# EAGLE schematic 12s9p_segment (EAGLE 9.2.2)

## Sheet 1 of 2
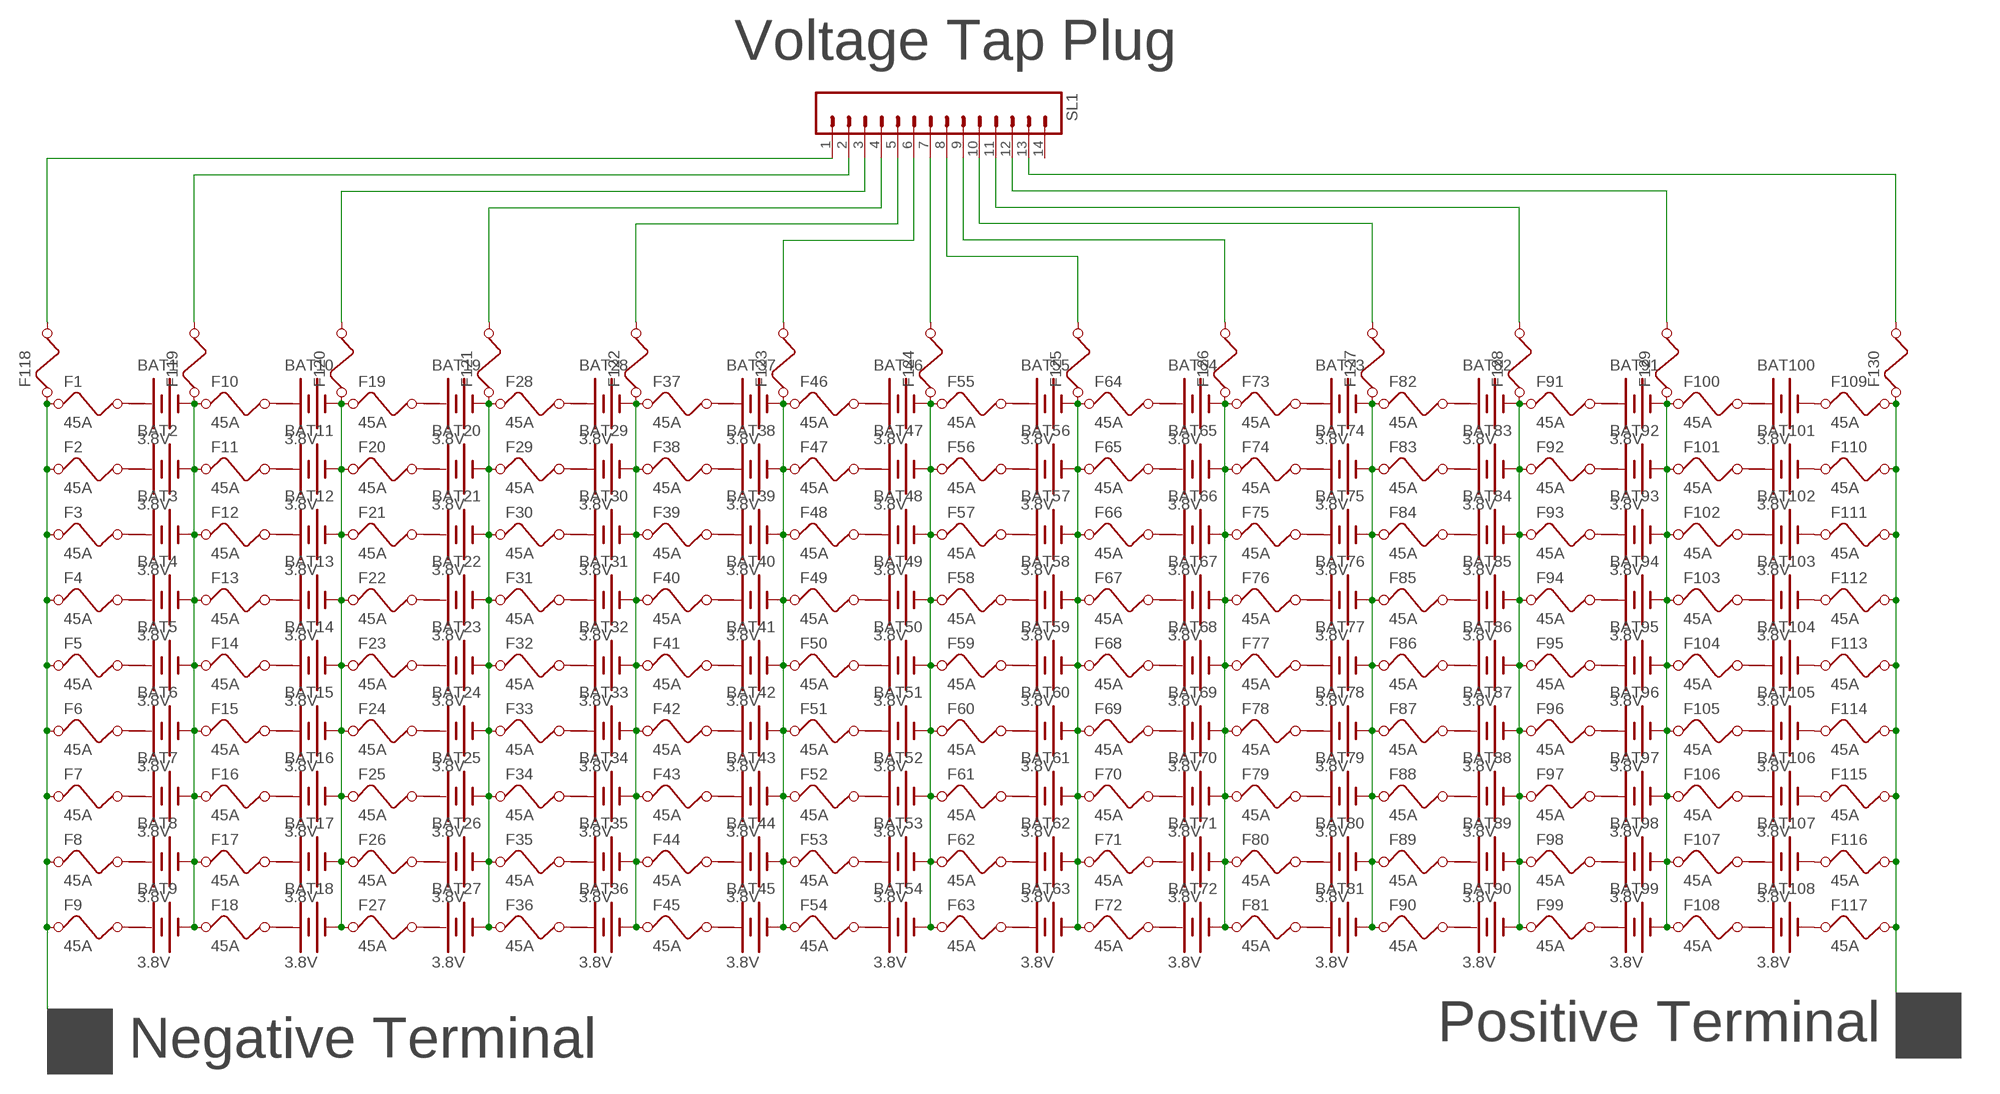
[diagram p0: schematic, sheet 1]

### Parts
BAT1  3.8V  BATTERY  [BATTERY]
BAT2  3.8V  BATTERY  [BATTERY]
BAT3  3.8V  BATTERY  [BATTERY]
BAT4  3.8V  BATTERY  [BATTERY]
BAT5  3.8V  BATTERY  [BATTERY]
BAT6  3.8V  BATTERY  [BATTERY]
BAT7  3.8V  BATTERY  [BATTERY]
BAT8  3.8V  BATTERY  [BATTERY]
BAT9  3.8V  BATTERY  [BATTERY]
BAT10  3.8V  BATTERY  [BATTERY]
BAT11  3.8V  BATTERY  [BATTERY]
BAT12  3.8V  BATTERY  [BATTERY]
BAT13  3.8V  BATTERY  [BATTERY]
BAT14  3.8V  BATTERY  [BATTERY]
BAT15  3.8V  BATTERY  [BATTERY]
BAT16  3.8V  BATTERY  [BATTERY]
BAT17  3.8V  BATTERY  [BATTERY]
BAT18  3.8V  BATTERY  [BATTERY]
BAT19  3.8V  BATTERY  [BATTERY]
BAT20  3.8V  BATTERY  [BATTERY]
BAT21  3.8V  BATTERY  [BATTERY]
BAT22  3.8V  BATTERY  [BATTERY]
BAT23  3.8V  BATTERY  [BATTERY]
BAT24  3.8V  BATTERY  [BATTERY]
BAT25  3.8V  BATTERY  [BATTERY]
BAT26  3.8V  BATTERY  [BATTERY]
BAT27  3.8V  BATTERY  [BATTERY]
BAT28  3.8V  BATTERY  [BATTERY]
BAT29  3.8V  BATTERY  [BATTERY]
BAT30  3.8V  BATTERY  [BATTERY]
BAT31  3.8V  BATTERY  [BATTERY]
BAT32  3.8V  BATTERY  [BATTERY]
BAT33  3.8V  BATTERY  [BATTERY]
BAT34  3.8V  BATTERY  [BATTERY]
BAT35  3.8V  BATTERY  [BATTERY]
BAT36  3.8V  BATTERY  [BATTERY]
BAT37  3.8V  BATTERY  [BATTERY]
BAT38  3.8V  BATTERY  [BATTERY]
BAT39  3.8V  BATTERY  [BATTERY]
BAT40  3.8V  BATTERY  [BATTERY]
BAT41  3.8V  BATTERY  [BATTERY]
BAT42  3.8V  BATTERY  [BATTERY]
BAT43  3.8V  BATTERY  [BATTERY]
BAT44  3.8V  BATTERY  [BATTERY]
BAT45  3.8V  BATTERY  [BATTERY]
BAT46  3.8V  BATTERY  [BATTERY]
BAT47  3.8V  BATTERY  [BATTERY]
BAT48  3.8V  BATTERY  [BATTERY]
BAT49  3.8V  BATTERY  [BATTERY]
BAT50  3.8V  BATTERY  [BATTERY]
BAT51  3.8V  BATTERY  [BATTERY]
BAT52  3.8V  BATTERY  [BATTERY]
BAT53  3.8V  BATTERY  [BATTERY]
BAT54  3.8V  BATTERY  [BATTERY]
BAT55  3.8V  BATTERY  [BATTERY]
BAT56  3.8V  BATTERY  [BATTERY]
BAT57  3.8V  BATTERY  [BATTERY]
BAT58  3.8V  BATTERY  [BATTERY]
BAT59  3.8V  BATTERY  [BATTERY]
BAT60  3.8V  BATTERY  [BATTERY]
BAT61  3.8V  BATTERY  [BATTERY]
BAT62  3.8V  BATTERY  [BATTERY]
BAT63  3.8V  BATTERY  [BATTERY]
BAT64  3.8V  BATTERY  [BATTERY]
BAT65  3.8V  BATTERY  [BATTERY]
BAT66  3.8V  BATTERY  [BATTERY]
BAT67  3.8V  BATTERY  [BATTERY]
BAT68  3.8V  BATTERY  [BATTERY]
BAT69  3.8V  BATTERY  [BATTERY]
BAT70  3.8V  BATTERY  [BATTERY]
BAT71  3.8V  BATTERY  [BATTERY]
BAT72  3.8V  BATTERY  [BATTERY]
BAT73  3.8V  BATTERY  [BATTERY]
BAT74  3.8V  BATTERY  [BATTERY]
BAT75  3.8V  BATTERY  [BATTERY]
BAT76  3.8V  BATTERY  [BATTERY]
BAT77  3.8V  BATTERY  [BATTERY]
BAT78  3.8V  BATTERY  [BATTERY]
BAT79  3.8V  BATTERY  [BATTERY]
BAT80  3.8V  BATTERY  [BATTERY]
BAT81  3.8V  BATTERY  [BATTERY]
BAT82  3.8V  BATTERY  [BATTERY]
BAT83  3.8V  BATTERY  [BATTERY]
BAT84  3.8V  BATTERY  [BATTERY]
BAT85  3.8V  BATTERY  [BATTERY]
BAT86  3.8V  BATTERY  [BATTERY]
BAT87  3.8V  BATTERY  [BATTERY]
BAT88  3.8V  BATTERY  [BATTERY]
BAT89  3.8V  BATTERY  [BATTERY]
BAT90  3.8V  BATTERY  [BATTERY]
BAT91  3.8V  BATTERY  [BATTERY]
BAT92  3.8V  BATTERY  [BATTERY]
BAT93  3.8V  BATTERY  [BATTERY]
BAT94  3.8V  BATTERY  [BATTERY]
BAT95  3.8V  BATTERY  [BATTERY]
BAT96  3.8V  BATTERY  [BATTERY]
BAT97  3.8V  BATTERY  [BATTERY]
BAT98  3.8V  BATTERY  [BATTERY]
BAT99  3.8V  BATTERY  [BATTERY]
BAT100  3.8V  BATTERY  [BATTERY]
BAT101  3.8V  BATTERY  [BATTERY]
BAT102  3.8V  BATTERY  [BATTERY]
BAT103  3.8V  BATTERY  [BATTERY]
BAT104  3.8V  BATTERY  [BATTERY]
BAT105  3.8V  BATTERY  [BATTERY]
BAT106  3.8V  BATTERY  [BATTERY]
BAT107  3.8V  BATTERY  [BATTERY]
BAT108  3.8V  BATTERY  [BATTERY]
F1  45A  FUSE  [FUSE]
F2  45A  FUSE  [FUSE]
F3  45A  FUSE  [FUSE]
F4  45A  FUSE  [FUSE]
F5  45A  FUSE  [FUSE]
F6  45A  FUSE  [FUSE]
F7  45A  FUSE  [FUSE]
F8  45A  FUSE  [FUSE]
F9  45A  FUSE  [FUSE]
F10  45A  FUSE  [FUSE]
F11  45A  FUSE  [FUSE]
F12  45A  FUSE  [FUSE]
F13  45A  FUSE  [FUSE]
F14  45A  FUSE  [FUSE]
F15  45A  FUSE  [FUSE]
F16  45A  FUSE  [FUSE]
F17  45A  FUSE  [FUSE]
F18  45A  FUSE  [FUSE]
F19  45A  FUSE  [FUSE]
F20  45A  FUSE  [FUSE]
F21  45A  FUSE  [FUSE]
F22  45A  FUSE  [FUSE]
F23  45A  FUSE  [FUSE]
F24  45A  FUSE  [FUSE]
F25  45A  FUSE  [FUSE]
F26  45A  FUSE  [FUSE]
F27  45A  FUSE  [FUSE]
F28  45A  FUSE  [FUSE]
F29  45A  FUSE  [FUSE]
F30  45A  FUSE  [FUSE]
F31  45A  FUSE  [FUSE]
F32  45A  FUSE  [FUSE]
F33  45A  FUSE  [FUSE]
F34  45A  FUSE  [FUSE]
F35  45A  FUSE  [FUSE]
F36  45A  FUSE  [FUSE]
F37  45A  FUSE  [FUSE]
F38  45A  FUSE  [FUSE]
F39  45A  FUSE  [FUSE]
F40  45A  FUSE  [FUSE]
F41  45A  FUSE  [FUSE]
F42  45A  FUSE  [FUSE]
F43  45A  FUSE  [FUSE]
F44  45A  FUSE  [FUSE]
F45  45A  FUSE  [FUSE]
F46  45A  FUSE  [FUSE]
F47  45A  FUSE  [FUSE]
F48  45A  FUSE  [FUSE]
F49  45A  FUSE  [FUSE]
F50  45A  FUSE  [FUSE]
F51  45A  FUSE  [FUSE]
F52  45A  FUSE  [FUSE]
F53  45A  FUSE  [FUSE]
F54  45A  FUSE  [FUSE]
F55  45A  FUSE  [FUSE]
F56  45A  FUSE  [FUSE]
F57  45A  FUSE  [FUSE]
F58  45A  FUSE  [FUSE]
F59  45A  FUSE  [FUSE]
F60  45A  FUSE  [FUSE]
F61  45A  FUSE  [FUSE]
F62  45A  FUSE  [FUSE]
F63  45A  FUSE  [FUSE]
F64  45A  FUSE  [FUSE]
F65  45A  FUSE  [FUSE]
F66  45A  FUSE  [FUSE]
F67  45A  FUSE  [FUSE]
F68  45A  FUSE  [FUSE]
F69  45A  FUSE  [FUSE]
F70  45A  FUSE  [FUSE]
F71  45A  FUSE  [FUSE]
F72  45A  FUSE  [FUSE]
F73  45A  FUSE  [FUSE]
F74  45A  FUSE  [FUSE]
F75  45A  FUSE  [FUSE]
F76  45A  FUSE  [FUSE]
F77  45A  FUSE  [FUSE]
F78  45A  FUSE  [FUSE]
F79  45A  FUSE  [FUSE]
F80  45A  FUSE  [FUSE]
F81  45A  FUSE  [FUSE]
F82  45A  FUSE  [FUSE]
F83  45A  FUSE  [FUSE]
F84  45A  FUSE  [FUSE]
F85  45A  FUSE  [FUSE]
F86  45A  FUSE  [FUSE]
F87  45A  FUSE  [FUSE]
F88  45A  FUSE  [FUSE]
F89  45A  FUSE  [FUSE]
F90  45A  FUSE  [FUSE]
F91  45A  FUSE  [FUSE]
F92  45A  FUSE  [FUSE]
F93  45A  FUSE  [FUSE]
F94  45A  FUSE  [FUSE]
F95  45A  FUSE  [FUSE]
F96  45A  FUSE  [FUSE]
F97  45A  FUSE  [FUSE]
F98  45A  FUSE  [FUSE]
F99  45A  FUSE  [FUSE]
F100  45A  FUSE  [FUSE]
F101  45A  FUSE  [FUSE]
F102  45A  FUSE  [FUSE]
F103  45A  FUSE  [FUSE]
F104  45A  FUSE  [FUSE]
F105  45A  FUSE  [FUSE]
F106  45A  FUSE  [FUSE]
F107  45A  FUSE  [FUSE]
F108  45A  FUSE  [FUSE]
F109  45A  FUSE  [FUSE]
F110  45A  FUSE  [FUSE]
F111  45A  FUSE  [FUSE]
F112  45A  FUSE  [FUSE]
F113  45A  FUSE  [FUSE]
F114  45A  FUSE  [FUSE]
F115  45A  FUSE  [FUSE]
F116  45A  FUSE  [FUSE]
F117  45A  FUSE  [FUSE]
F118  FUSE  [FUSE]
F119  FUSE  [FUSE]
F120  FUSE  [FUSE]
F121  FUSE  [FUSE]
F122  FUSE  [FUSE]
F123  FUSE  [FUSE]
F124  FUSE  [FUSE]
F125  FUSE  [FUSE]
F126  FUSE  [FUSE]
F127  FUSE  [FUSE]
F128  FUSE  [FUSE]
F129  FUSE  [FUSE]
F130  FUSE  [FUSE]
SL1  M14  [14P]

### Nets
N$1: BAT1.+ F1.2
N$2: BAT2.+ F2.2
N$3: BAT10.+ F10.2
N$4: BAT3.+ F3.2
N$5: BAT1.- BAT2.- BAT3.- BAT4.- BAT5.- BAT6.- BAT7.- BAT8.- BAT9.- F10.1 F11.1 F12.1 F13.1 F14.1 F15.1 F16.1 F17.1 F18.1 F119.1
N$6: BAT4.+ F4.2
N$7: BAT11.+ F11.2
N$8: BAT5.+ F5.2
N$9: BAT12.+ F12.2
N$10: F1.1 F2.1 F3.1 F4.1 F5.1 F6.1 F7.1 F8.1 F9.1 F118.1
N$11: BAT6.+ F6.2
N$12: BAT13.+ F13.2
N$13: BAT7.+ F7.2
N$14: BAT14.+ F14.2
N$15: BAT8.+ F8.2
N$16: BAT15.+ F15.2
N$17: BAT9.+ F9.2
N$18: BAT16.+ F16.2
N$19: BAT17.+ F17.2
N$20: BAT18.+ F18.2
N$21: BAT19.+ F19.2
N$22: BAT10.- BAT11.- BAT12.- BAT13.- BAT14.- BAT15.- BAT16.- BAT17.- BAT18.- F19.1 F20.1 F21.1 F22.1 F23.1 F24.1 F25.1 F26.1 F27.1 F120.1
N$23: BAT20.+ F20.2
N$24: BAT21.+ F21.2
N$25: BAT22.+ F22.2
N$26: BAT23.+ F23.2
N$27: BAT24.+ F24.2
N$28: BAT25.+ F25.2
N$29: BAT26.+ F26.2
N$30: BAT27.+ F27.2
N$31: BAT28.+ F28.2
N$32: BAT19.- BAT20.- BAT21.- BAT22.- BAT23.- BAT24.- BAT25.- BAT26.- BAT27.- F28.1 F29.1 F30.1 F31.1 F32.1 F33.1 F34.1 F35.1 F36.1 F121.1
N$33: BAT29.+ F29.2
N$34: BAT30.+ F30.2
N$35: BAT31.+ F31.2
N$36: BAT32.+ F32.2
N$37: BAT33.+ F33.2
N$38: BAT34.+ F34.2
N$39: BAT35.+ F35.2
N$40: BAT36.+ F36.2
N$41: BAT37.+ F37.2
N$42: BAT28.- BAT29.- BAT30.- BAT31.- BAT32.- BAT33.- BAT34.- BAT35.- BAT36.- F37.1 F38.1 F39.1 F40.1 F41.1 F42.1 F43.1 F44.1 F45.1 F122.1
N$43: BAT38.+ F38.2
N$44: BAT39.+ F39.2
N$45: BAT40.+ F40.2
N$46: BAT41.+ F41.2
N$47: BAT42.+ F42.2
N$48: BAT43.+ F43.2
N$49: BAT44.+ F44.2
N$50: BAT45.+ F45.2
N$51: BAT46.+ F46.2
N$52: BAT37.- BAT38.- BAT39.- BAT40.- BAT41.- BAT42.- BAT43.- BAT44.- BAT45.- F46.1 F47.1 F48.1 F49.1 F50.1 F51.1 F52.1 F53.1 F54.1 F123.1
N$53: BAT47.+ F47.2
N$54: BAT48.+ F48.2
N$55: BAT49.+ F49.2
N$56: BAT50.+ F50.2
N$57: BAT51.+ F51.2
N$58: BAT52.+ F52.2
N$59: BAT53.+ F53.2
N$60: BAT54.+ F54.2
N$61: BAT55.+ F55.2
N$62: BAT46.- BAT47.- BAT48.- BAT49.- BAT50.- BAT51.- BAT52.- BAT53.- BAT54.- F55.1 F56.1 F57.1 F58.1 F59.1 F60.1 F61.1 F62.1 F63.1 F124.1
N$63: BAT56.+ F56.2
N$64: BAT57.+ F57.2
N$65: BAT58.+ F58.2
N$66: BAT59.+ F59.2
N$67: BAT60.+ F60.2
N$68: BAT61.+ F61.2
N$69: BAT62.+ F62.2
N$70: BAT63.+ F63.2
N$71: BAT64.+ F64.2
N$72: BAT55.- BAT56.- BAT57.- BAT58.- BAT59.- BAT60.- BAT61.- BAT62.- BAT63.- F64.1 F65.1 F66.1 F67.1 F68.1 F69.1 F70.1 F71.1 F72.1 F125.1
N$73: BAT65.+ F65.2
N$74: BAT66.+ F66.2
N$75: BAT67.+ F67.2
N$76: BAT68.+ F68.2
N$77: BAT69.+ F69.2
N$78: BAT70.+ F70.2
N$79: BAT71.+ F71.2
N$80: BAT72.+ F72.2
N$81: BAT73.+ F73.2
N$82: BAT64.- BAT65.- BAT66.- BAT67.- BAT68.- BAT69.- BAT70.- BAT71.- BAT72.- F73.1 F74.1 F75.1 F76.1 F77.1 F78.1 F79.1 F80.1 F81.1 F126.1
N$83: BAT74.+ F74.2
N$84: BAT75.+ F75.2
N$85: BAT76.+ F76.2
N$86: BAT77.+ F77.2
N$87: BAT78.+ F78.2
N$88: BAT79.+ F79.2
N$89: BAT80.+ F80.2
N$90: BAT81.+ F81.2
N$91: BAT82.+ F82.2
N$92: BAT73.- BAT74.- BAT75.- BAT76.- BAT77.- BAT78.- BAT79.- BAT80.- BAT81.- F82.1 F83.1 F84.1 F85.1 F86.1 F87.1 F88.1 F89.1 F90.1 F127.1
N$93: BAT83.+ F83.2
N$94: BAT84.+ F84.2
N$95: BAT85.+ F85.2
N$96: BAT86.+ F86.2
N$97: BAT87.+ F87.2
N$98: BAT88.+ F88.2
N$99: BAT89.+ F89.2
N$100: BAT90.+ F90.2
N$101: BAT91.+ F91.2
N$102: BAT82.- BAT83.- BAT84.- BAT85.- BAT86.- BAT87.- BAT88.- BAT89.- BAT90.- F91.1 F92.1 F93.1 F94.1 F95.1 F96.1 F97.1 F98.1 F99.1 F128.1
N$103: BAT92.+ F92.2
N$104: BAT93.+ F93.2
N$105: BAT94.+ F94.2
N$106: BAT95.+ F95.2
N$107: BAT96.+ F96.2
N$108: BAT97.+ F97.2
N$109: BAT98.+ F98.2
N$110: BAT99.+ F99.2
N$111: BAT100.+ F100.2
N$112: BAT91.- BAT92.- BAT93.- BAT94.- BAT95.- BAT96.- BAT97.- BAT98.- BAT99.- F100.1 F101.1 F102.1 F103.1 F104.1 F105.1 F106.1 F107.1 F108.1 F129.1
N$113: BAT101.+ F101.2
N$114: BAT102.+ F102.2
N$115: BAT103.+ F103.2
N$116: BAT104.+ F104.2
N$117: BAT105.+ F105.2
N$118: BAT106.+ F106.2
N$119: BAT107.+ F107.2
N$120: BAT108.+ F108.2
N$121: BAT100.- F109.1
N$122: BAT101.- F110.1
N$123: BAT102.- F111.1
N$124: BAT103.- F112.1
N$125: BAT104.- F113.1
N$126: BAT105.- F114.1
N$127: BAT106.- F115.1
N$128: BAT107.- F116.1
N$129: BAT108.- F117.1
N$130: F109.2 F110.2 F111.2 F112.2 F113.2 F114.2 F115.2 F116.2 F117.2 F130.1
N$131: F118.2 SL1.1
N$132: F119.2 SL1.2
N$133: F120.2 SL1.3
N$134: F121.2 SL1.4
N$135: F122.2 SL1.5
N$136: F123.2 SL1.6
N$137: F124.2 SL1.7
N$138: F130.2 SL1.13
N$139: F129.2 SL1.12
N$140: F128.2 SL1.11
N$141: F127.2 SL1.10
N$142: F126.2 SL1.9
N$143: F125.2 SL1.8
Unconnected: SL1.14

### Notes on the sheet
- Voltage Tap Plug
- Negative Terminal | Positive Terminal

## Sheet 2 of 2

## Power pins joined to a net without a drawn wire
+: BAT1.+@1(+) BAT2.+@1(+) BAT3.+@1(+) BAT4.+@1(+) BAT5.+@1(+) BAT6.+@1(+) BAT7.+@1(+) BAT8.+@1(+) BAT9.+@1(+) BAT10.+@1(+) BAT11.+@1(+) BAT12.+@1(+) BAT13.+@1(+) BAT14.+@1(+) BAT15.+@1(+) BAT16.+@1(+) BAT17.+@1(+) BAT18.+@1(+) BAT19.+@1(+) BAT20.+@1(+) BAT21.+@1(+) BAT22.+@1(+) BAT23.+@1(+) BAT24.+@1(+) BAT25.+@1(+) BAT26.+@1(+) BAT27.+@1(+) BAT28.+@1(+) BAT29.+@1(+) BAT30.+@1(+) BAT31.+@1(+) BAT32.+@1(+) BAT33.+@1(+) BAT34.+@1(+) BAT35.+@1(+) BAT36.+@1(+) BAT37.+@1(+) BAT38.+@1(+) BAT39.+@1(+) BAT40.+@1(+) BAT41.+@1(+) BAT42.+@1(+) BAT43.+@1(+) BAT44.+@1(+) BAT45.+@1(+) BAT46.+@1(+) BAT47.+@1(+) BAT48.+@1(+) BAT49.+@1(+) BAT50.+@1(+) BAT51.+@1(+) BAT52.+@1(+) BAT53.+@1(+) BAT54.+@1(+) BAT55.+@1(+) BAT56.+@1(+) BAT57.+@1(+) BAT58.+@1(+) BAT59.+@1(+) BAT60.+@1(+) BAT61.+@1(+) BAT62.+@1(+) BAT63.+@1(+) BAT64.+@1(+) BAT65.+@1(+) BAT66.+@1(+) BAT67.+@1(+) BAT68.+@1(+) BAT69.+@1(+) BAT70.+@1(+) BAT71.+@1(+) BAT72.+@1(+) BAT73.+@1(+) BAT74.+@1(+) BAT75.+@1(+) BAT76.+@1(+) BAT77.+@1(+) BAT78.+@1(+) BAT79.+@1(+) BAT80.+@1(+) BAT81.+@1(+) BAT82.+@1(+) BAT83.+@1(+) BAT84.+@1(+) BAT85.+@1(+) BAT86.+@1(+) BAT87.+@1(+) BAT88.+@1(+) BAT89.+@1(+) BAT90.+@1(+) BAT91.+@1(+) BAT92.+@1(+) BAT93.+@1(+) BAT94.+@1(+) BAT95.+@1(+) BAT96.+@1(+) BAT97.+@1(+) BAT98.+@1(+) BAT99.+@1(+) BAT100.+@1(+) BAT101.+@1(+) BAT102.+@1(+) BAT103.+@1(+) BAT104.+@1(+) BAT105.+@1(+) BAT106.+@1(+) BAT107.+@1(+) BAT108.+@1(+)

## Library data of the parts
BAT1-BAT108 = special:BATTERY: BATTERY
F1-F130 = special:FUSE: FUSE 5 x 20 mm
SL1 = con-amp-quick:M14: AMP QUICK CONNECTOR; OC_FARNELL: unknown; OC_NEWARK: unknown